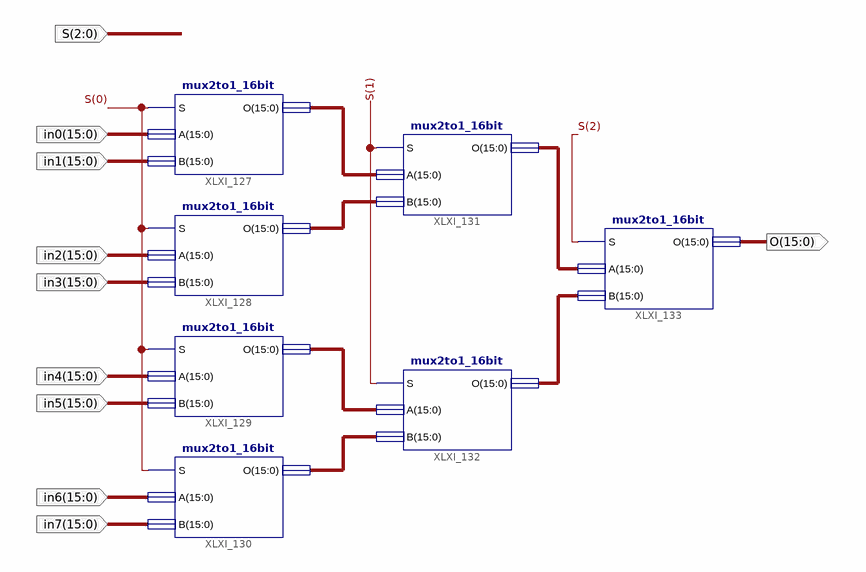
[diagram p0: schematic sheet 1]
// Xilinx ISE schematic mux8to1_16bit.sch (spartan6) as structural Verilog: 7 symbols, 10 ports
module mux8to1_16bit (
  input  [15:0] in0,
  input  [15:0] in1,
  input  [15:0] in2,
  input  [15:0] in3,
  input  [15:0] in4,
  input  [15:0] in5,
  input  [15:0] in6,
  input  [15:0] in7,
  input  [2:0] S,
  output [15:0] O
);

  wire [15:0] XLXN_1, XLXN_2, XLXN_3, XLXN_4, XLXN_5, XLXN_6;

  mux2to1_16bit XLXI_127 (.S(S[0]), .A(in0), .B(in1), .O(XLXN_1));
  mux2to1_16bit XLXI_128 (.S(S[0]), .A(in2), .B(in3), .O(XLXN_2));
  mux2to1_16bit XLXI_129 (.S(S[0]), .A(in4), .B(in5), .O(XLXN_3));
  mux2to1_16bit XLXI_130 (.S(S[0]), .A(in6), .B(in7), .O(XLXN_4));
  mux2to1_16bit XLXI_131 (.S(S[1]), .A(XLXN_1), .B(XLXN_2), .O(XLXN_5));
  mux2to1_16bit XLXI_132 (.S(S[1]), .A(XLXN_3), .B(XLXN_4), .O(XLXN_6));
  mux2to1_16bit XLXI_133 (.S(S[2]), .A(XLXN_5), .B(XLXN_6), .O(O));
endmodule
